# Altium schematic sheet Optical Decoder Schematic.SchDoc
size A4
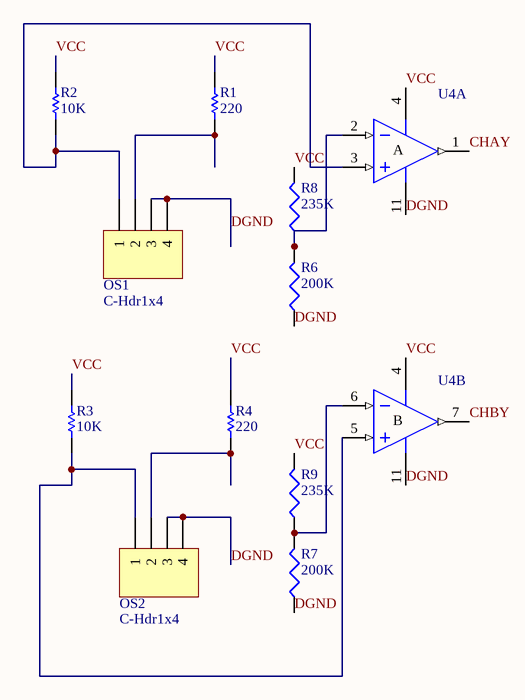
[diagram p0: Optical Decoder Schematic.SchDoc]

## Parts
OS1  C-Hdr1x4  [HDR1X4_LGE1.0]
OS2  C-Hdr1x4  [HDR1X4_LGE1.0]
R1  220  [AXIAL-0.3]
R2  10K  [AXIAL-0.3]
R3  10K  [AXIAL-0.3]
R4  220  [AXIAL-0.3]
R6  200K  [Res10mm_LGE1.0]
R7  200K  [Res10mm_LGE1.0]
R8  235K  [Res10mm_LGE1.0]
R9  235K  [Res10mm_LGE1.0]
U4  O-OpAmp074  [DIP14_LGE1.0]  (value not drawn)  (parts A,B of 4)

## Nets
CHAY: U4.1(OUT)
CHBY: U4.7(OUT)
DGND: OS1.3 OS1.4 OS2.3 OS2.4 R6.1 R7.1 U4.11(V-)
VCC: R1.2 R2.2 R3.2 R4.2 R8.2 R9.2 U4.4(V+)
NetOS1_1: OS1.1 R2.1 U4.3(IN+)
NetOS1_2: OS1.2 R1.1
NetOS2_1: OS2.1 R3.1 U4.5(IN+)
NetOS2_2: OS2.2 R4.1
NetR6_2: R6.2 R8.1 U4.2(IN-)
NetR7_2: R7.2 R9.1 U4.6(IN-)

## Notes on the sheet
- (in symbol O-OpAmp074, part A) A
- (in symbol O-OpAmp074, part B) B

## Library data of the parts
OS1 OS2 = C-Hdr1x4: Header, 4-Pin; LatestRevisionDate: 17-Jul-2002; LatestRevisionNote: Re-released for DXP Platform.; Publisher: Altium Limited
R1-R4 = Res1: Resistor; Published: 8-Jun-2000; LatestRevisionDate: 17-Jul-2002; LatestRevisionNote: Re-released for DXP Platform.; PackageReference: AXIAL-0.3; Publisher: Altium Limited; PackageDescription: Axial Device, Thru-Hole; 2 Leads; 0.3 in Pin Spacing
  R1 R4: Value: 220
  R2 R3: Value: 10K
R6-R9 = G-Res: resistor (specify value); Published: 8-Jun-2000; LatestRevisionDate: 29-May-2009; LatestRevisionNote: IPC-7351 Footprint Added.; PackageReference: J1-0603; Publisher: Altium Limited; PackageDescription: Chip Resistor
  R6 R7: Value: 200K
  R8 R9: Value: 235K
U4 = O-OpAmp074: op amp (TL074); Published: 24-Aug-2001; LatestRevisionDate: 06-Jun-2005; LatestRevisionNote: Stylized 3D Model Added.; DatasheetVersion: Dec-1998; PackageVersion: Jan-1997; PackageReference: DIP14; Publisher: Altium Limited; PackageDescription: DIP; 14 Leads; Row Spacing 7.62 mm; Pitch 2.54 mm; ComponentLink1Description: Manufacturer Link; ComponentLink1URL: http://www.st.com/; ComponentLink2Description: Datasheet; ComponentLink2URL: http://www.st.com/stonline/products/literature/ds/2297/tl074.pdf